# EasyEDA Pro project ProPrj_电赛版12_2025-08-14.epro, board PCB1
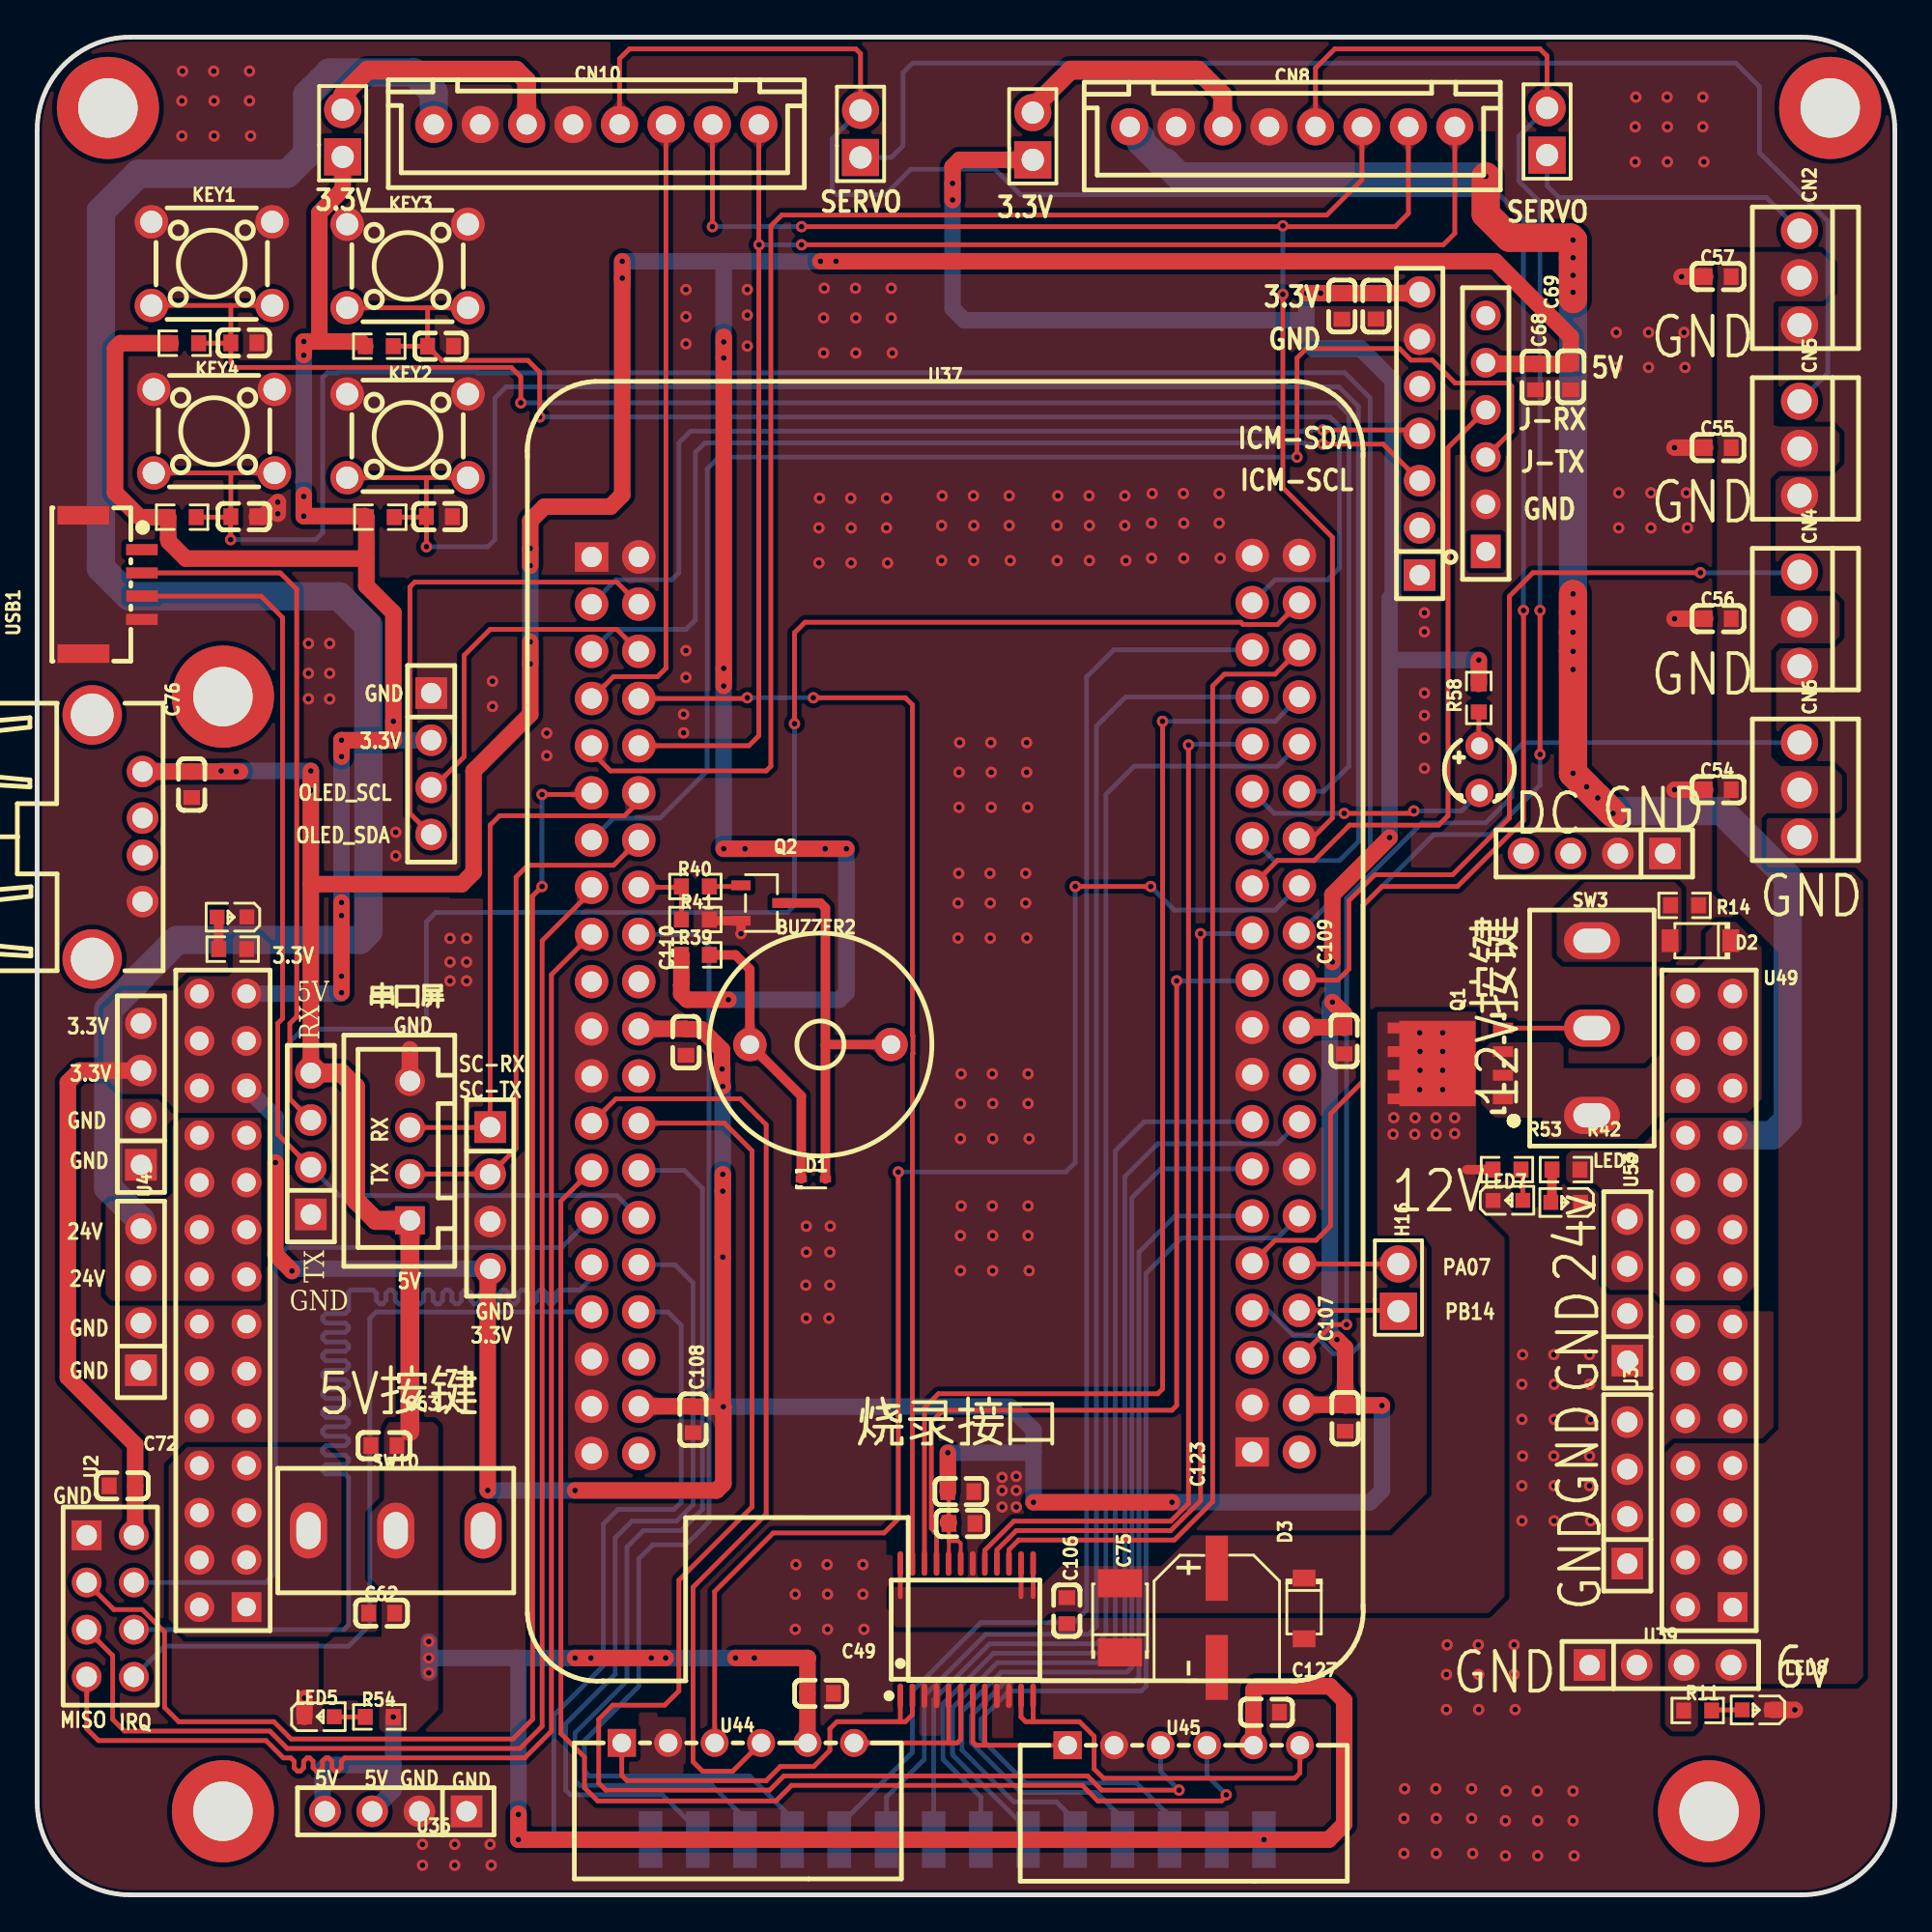
[diagram p4: board, top side]
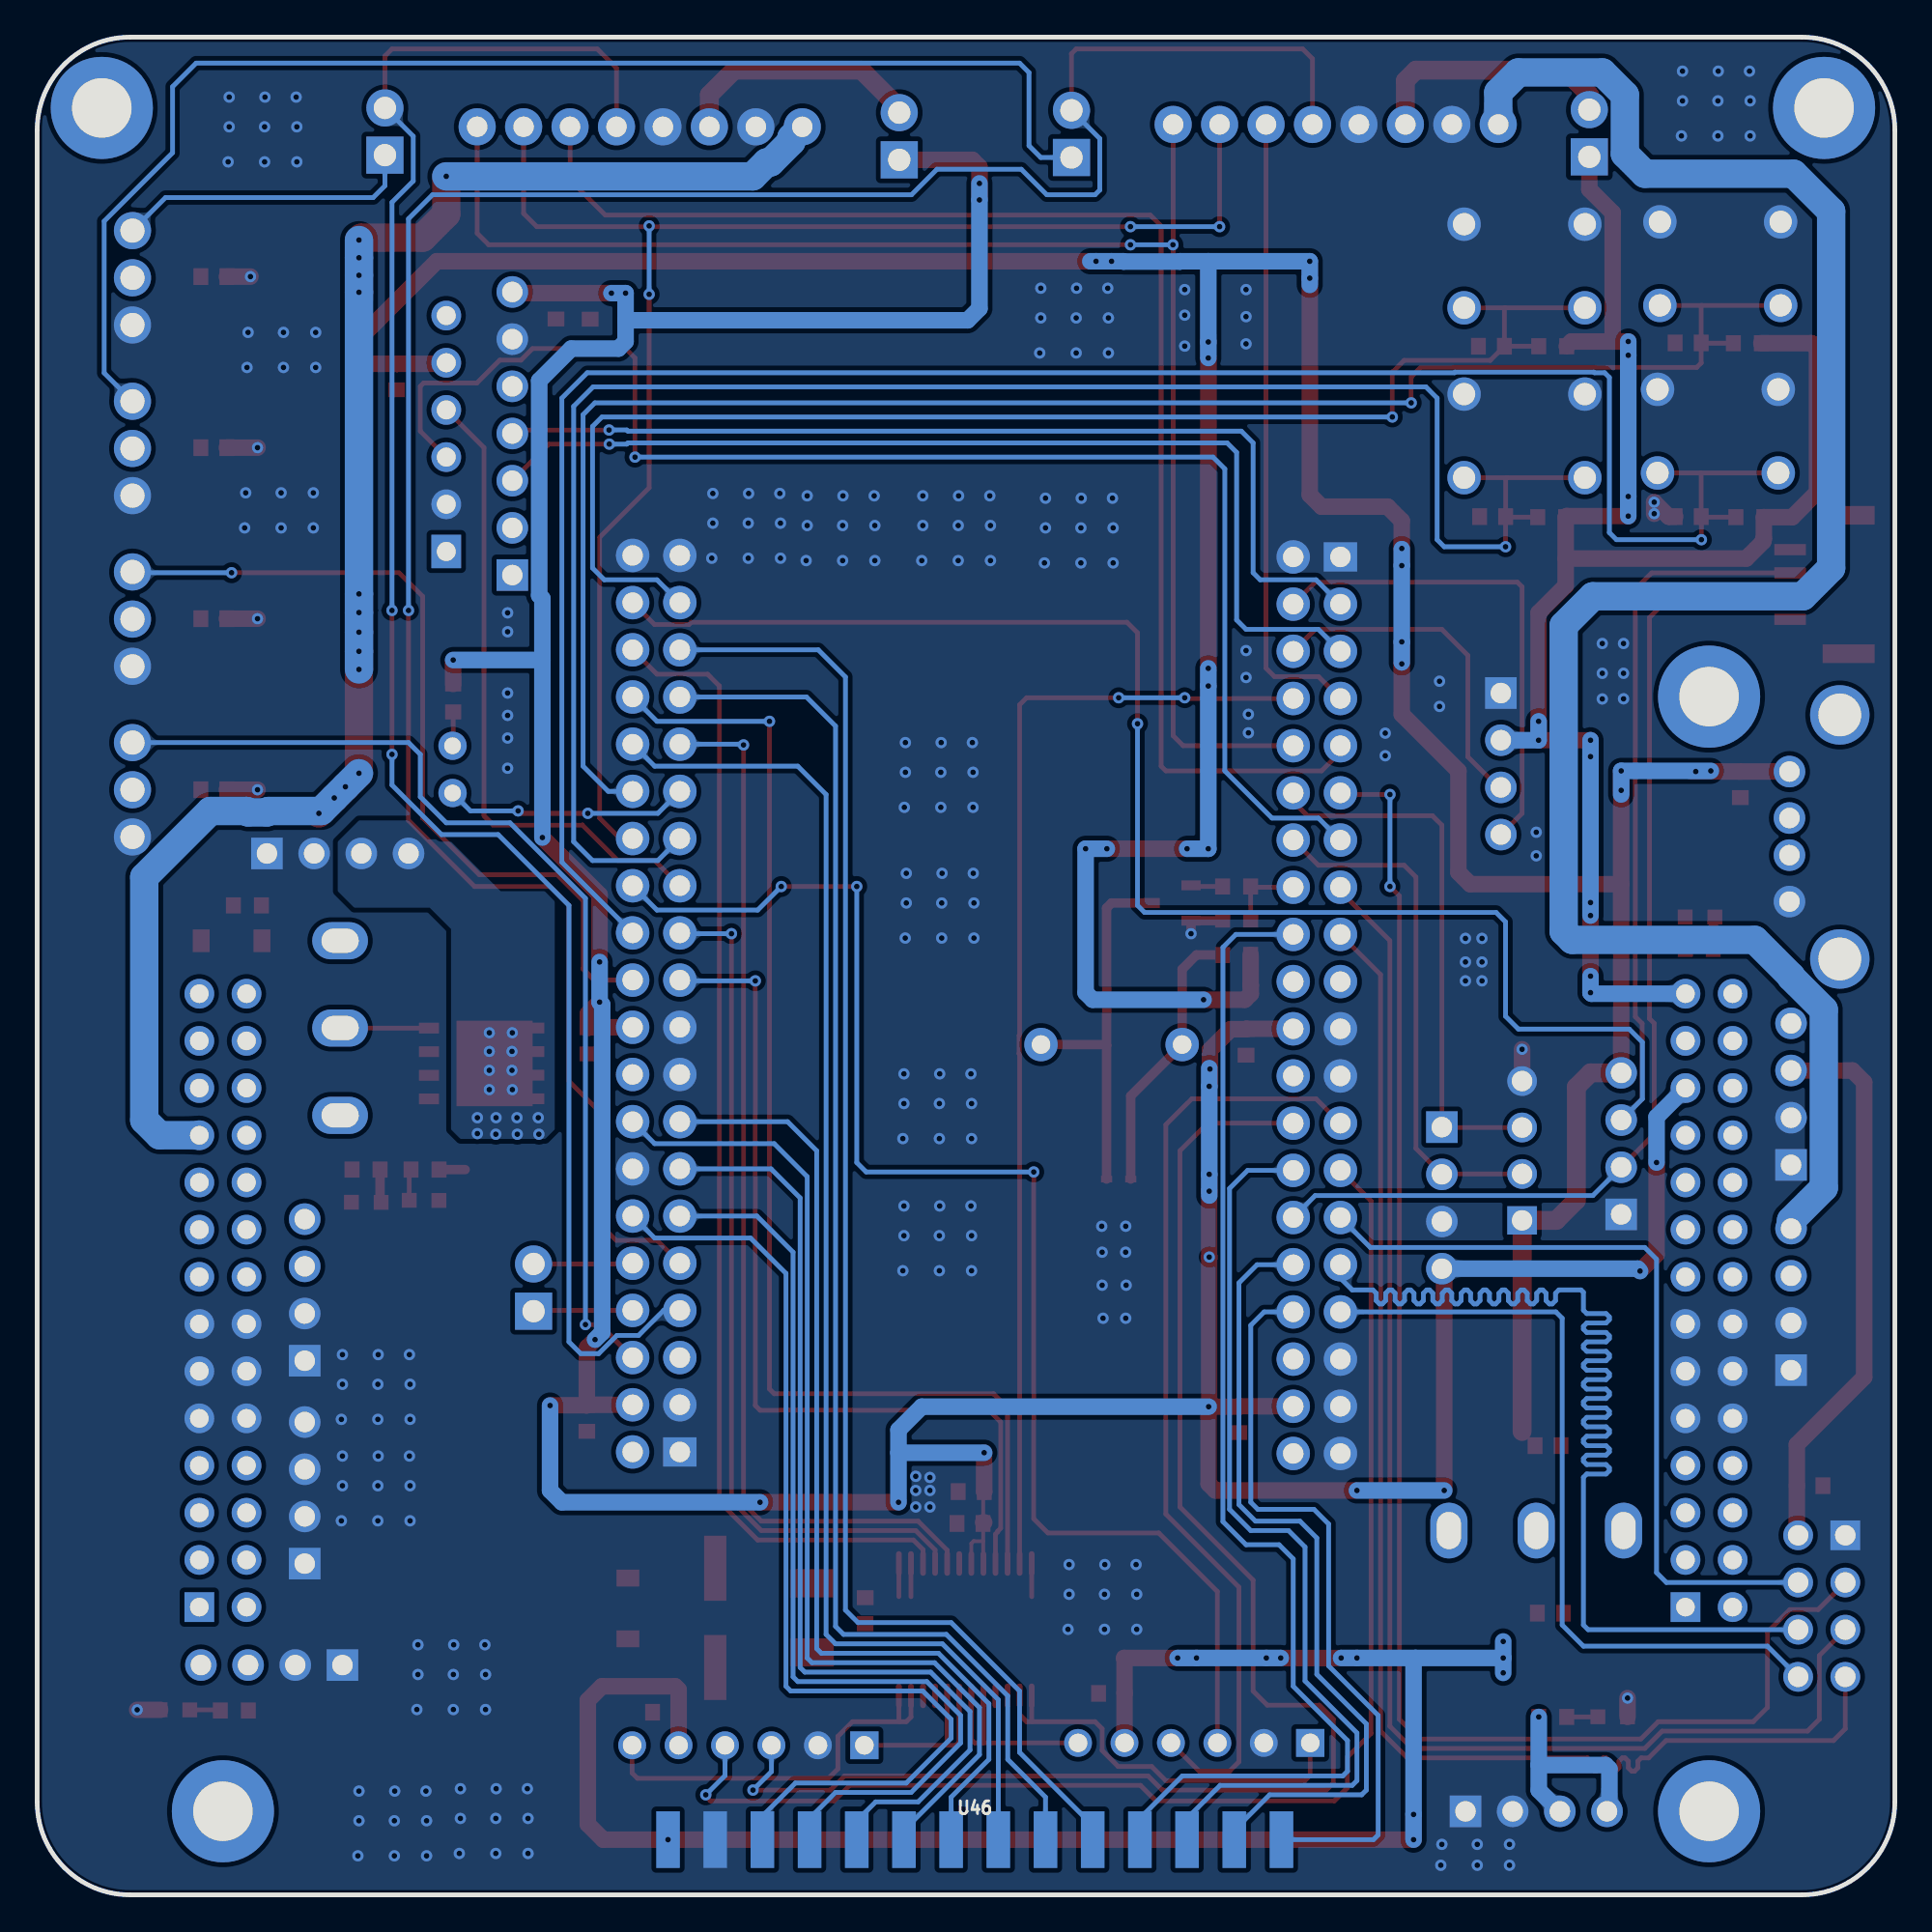
[diagram p5: board, bottom side, seen from below]

Outline 100 x 100 mm; copper layers: Top Layer, Bottom Layer. Coordinates in mm from the lower left corner of the outline.
Outline path: 0,95 0,5 arc(1.46,1.46) 5,0 95,0 arc(98.54,1.46) 100,5 100,95 arc(98.54,98.54) 95,100 5,100 arc(1.46,98.54) 0,95
Stack: Top Layer 0.035mm / Dielectric1 1.51mm FR4 er 4.5 / Bottom Layer 0.035mm

## Design rules (mm)
template: 自定义配置
spacing copperThickness1oz (default): track to track 0.102, other pairs 0.152 to 0.3
spacing copperThickness2oz: track to track 0.203, other pairs 0.152 to 0.3
track width copperThickness1oz (default): min 0.152, default 0.254, max 0.508
track width VCC: min 0.203, default 0.889, max 1.27
track width motor: min 0.762, default 1.524, max 2.54
differential pair differentialPair (default): width min 0.127, default 0.254, max 2.54; gap min 0.152, default 0.152
via viaSize (default): diameter min 0.5, default 0.61, max 10; hole min 0.3, default 0.305, max 6.299
net +5V uses VCC
net GND uses VCC
net +6V uses VCC
net 3.3V uses VCC
net +3V3_V2 uses VCC
net 24V_2 uses motor
net +3V3_V1 uses VCC
net 24V_1 uses motor
net +POW uses VCC
net 5V uses VCC
net PB2 uses netLength
net MOSI uses netLength
net MISO uses netLength
eq len grp SPI uses netLength

## Placement (name value [footprint] x y rotation side)
BUZZER2  2300Hz  [BUZ-TH_BD12.0-P7.60-D0.6-FD]  42.16 45.77 0 top
C49  100nF  [C0603]  42.16 10.85 180 top
C54  100nF  [C0603]  90.49 59.49 0 top
C55  100nF  [C0603]  90.49 77.9 0 top
C56  100nF  [C0603]  90.49 68.69 0 top
C57  100nF  [C0603]  90.49 87.11 0 top
C62  10uF  [C0603]  18.55 15.16 0 top
C63  0.1uF  [C0603]  18.67 24.18 180 top
C68  10uF  [C0603]  80.65 81.71 90 top
C69  0.1uF  [C0603]  82.55 81.71 270 top
C72  100nF  [C0603]  4.58 22.02 180 top
C73  10uF  [C0603]  72.07 85.53 90 top
C74  0.1uF  [C0603]  70.23 85.52 270 top
C75  10uF  [CASE-B_3528]  58.29 14.91 90 top
C76  100nF  [C0603]  8.32 59.77 270 top
C98  100nF  [C0603]  49.72 21.71 180 top
C99  100nF  [C0603]  49.78 19.99 180 top
C102  100nF  [C0603]  11.12 74.19 180 top
C103  100nF  [C0603]  21.65 74.19 180 top
C106  100nF  [C0603]  55.43 15.3 90 top
C107  100nF  [C0603]  70.41 25.65 270 top
C108  100nF  [C0603]  35.31 25.58 90 top
C109  100nF  [C0603]  70.35 45.97 270 top
C110  100nF  [C0603]  34.93 45.9 270 top
C123  10uF  [CAP-SMD_BD6.3-L6.6-W6.6-FD]  63.5 14.91 270 top
C125  100nF  [C0603]  11.12 83.54 180 top
C126  100nF  [C0603]  21.72 83.36 180 top
C127  100nF  [C0603]  66.17 9.83 180 top
CN2  640456-3  [CONN-TH_640456-3]  94.87 87.05 90 top
CN4  640456-3  [CONN-TH_640456-3]  94.87 68.67 90 top
CN5  640456-3  [CONN-TH_640456-3]  94.87 77.86 90 top
CN6  640456-3  [CONN-TH_640456-3]  94.87 59.49 90 top
CN7  ZX-XH2.54-4PZZ  [CONN-TH_4P-P2.50_4PIN]  20.07 40.06 90 top
CN8  ZX-XH2.54-8PZZ  [CONN-TH_8P-P2.50-XH2.54-8P]  67.56 95.17 0 top
CN10  ZX-XH2.54-8PZZ  [CONN-TH_8P-P2.50-XH2.54-8P]  30.1 95.3 0 top
D1  1N4148WT  [SOD-523_L1.2-W0.8-LS1.6-RD]  41.78 38.53 0 top
D2  BZT52C16  [SOD-123_L2.7-W1.6-LS3.7-RD]  89.53 51.36 180 top
D3  BZT52C16  [SOD-123_L2.7-W1.6-LS3.7-RD]  68.2 15.42 270 top
H1  PZ254V-11-07P  [HDR-TH_7P-P2.54-V-M]  74.42 78.66 90 top
H11  PZ254V-11-02P  [HDR-TH_2P-P2.54-V-M]  53.59 94.67 90 top
H12  2.54-1*4P母  [hdr-th_4p-p2.54-v-f]  21.21 60.88 270 top
H13  PZ254V-11-02P  [HDR-TH_2P-P2.54-V-M]  81.28 94.92 90 top
H14  PZ254V-11-02P  [HDR-TH_2P-P2.54-V-M]  16.45 94.83 90 top
H15  PZ254V-11-02P  [HDR-TH_2P-P2.54-V-M]  44.32 94.79 90 top
H16  PZ254V-11-02P  [HDR-TH_2P-P2.54-V-M]  73.28 32.69 90 top
KEY1  TS665CJ  [SW-TH_4P-L6.0-W6.0-P4.50-LS6.5]  9.4 87.81 0 top
KEY2  TS665CJ  [SW-TH_4P-L6.0-W6.0-P4.50-LS6.5]  19.94 78.54 0 top
KEY3  TS665CJ  [SW-TH_4P-L6.0-W6.0-P4.50-LS6.5]  19.94 87.68 0 top
KEY4  TS665CJ  [SW-TH_4P-L6.0-W6.0-P4.50-LS6.5]  9.53 78.79 0 top
LED4  XL-1608SURC-06  [LED0603-RD_RED]  10.49 52.64 180 top
LED5  XL-1608SURC-06  [LED0603-RD_RED]  15.19 9.58 0 top
LED7  XL-1608SURC-06  [LED0603-RD_RED]  79.17 37.38 0 top
LED8  XL-1608SURC-06  [LED0603-RD_RED]  92.58 9.96 180 top
LED9  XL-1608SURC-06  [LED0603-RD_RED]  82.28 37.28 180 top
LED11  XL-302SURD  [LED-TH_BD3.8-P2.54-RD]  77.64 60.58 90 top
NOREF  -  [Pad_e109]  96.52 96.19 0 top
NOREF#2  -  [Pad_e105]  10 64.5 0 top
NOREF#3  -  [Pad_e103]  90 4.5 0 top
NOREF#4  -  [Pad_e108]  3.81 96.19 0 top
NOREF#5  -  [Pad_e104]  10 4.5 0 top
P1  2.54-1*6P母  [hdr-th_6p-p2.54-v-f]  77.98 78.66 90 top
Q1  AON6403-VB  [PDFN-8_L4.9-W5.8-P1.27-LS6.1-BL]  76.07 44.75 90 top
Q2  S8050 J3Y  [SOT-23-3_L3.0-W1.7-P0.95-LS2.9-BR]  38.99 53.39 180 top
R11  1K  [R0603]  89.39 9.93 0 top
R14  10K  [R0603]  88.68 53.26 180 top
R39  10Ω  [R0603]  35.43 50.6 0 top
R40  4.7kΩ  [R0603]  35.43 54.28 0 top
R41  1kΩ  [R0603]  35.43 52.5 0 top
R42  8K  [R0603]  82.3 39.04 180 top
R44  10kΩ  [R0603]  18.47 74.16 0 top
R46  10kΩ  [R0603]  7.81 74.16 0 top
R53  1kΩ  [R0603]  79.12 39.04 180 top
R54  1kΩ  [R0603]  18.42 9.58 0 top
R55  1kΩ  [R0603]  10.53 50.91 0 top
R58  1kΩ  [R0603]  77.61 64.43 90 top
R59  10kΩ  [R0603]  7.94 83.53 0 top
R60  10kΩ  [R0603]  18.42 83.36 0 top
SW3  SS-12D10L5  [SW-TH_SS-12D10L5]  83.69 46.66 270 top
SW10  SS-12D10L5  [SW-TH_SS-12D10L5]  19.3 19.61 0 top
U2  2.54-2*4  [HDR-TH_8P-P2.54-V-F-R2-C4-S2.54]  3.94 15.54 270 top
U35  PM254-1-04-Z-8.5  [hdr-th_4p-p2.54-v-f]  14.73 40.44 90 top
U36  PM254-1-04-Z-8.5  [hdr-th_4p-p2.54-v-f]  19.3 4.5 180 top
U37  LCKFB-TMX-MSPM0G3507  [COMM-TH_LCKFB-TMX-MSPM0G3507]  48.9 47.93 0 top
U38  PM254-1-04-Z-8.5  [hdr-th_4p-p2.54-v-f]  85.6 21.64 90 top
U39  PM254-1-04-Z-8.5  [hdr-th_4p-p2.54-v-f]  87.38 12.37 0 top
U40  TB6612FNG,C,8,EL  [SSOP-24_L8.3-W5.6-P0.65-LS7.6-BL]  50.04 14.28 0 top
U41  PM254-1-04-Z-8.5  [hdr-th_4p-p2.54-v-f]  5.59 32.06 90 top
U44  ZX-XH2.54-6PWZ  [CONN-TH_6P-P2.50_ZX-XH2.54-6PWZ]  37.72 8.18 0 top
U45  ZX-XH2.54-6PWZ  [CONN-TH_6P-P2.50_ZX-XH2.54-6PWZ]  61.72 8.05 0 top
U46  PM254-1-14-Z-8.5  [HDR-TH_14P-P2.54-V-F-1]  49.53 2.97 180 bottom
U48  WAFER-GH1.25-4PWB  [CONN-SMD_4P-P1.25_XUNPU_WAFER-GH1.25-4PWB]  4.06 70.54 270 top
U49  HC-PM254-8.5H-2x14PZ  [HDR-TH_28P-P2.54-V-F-R2-C14-S2.54]  90 32 90 top
U50  HC-PM254-8.5H-2x14PZ  [HDR-TH_28P-P2.54-V-F-R2-C14-S2.54]  10 32 90 top
U51  PM254-1-04-Z-8.5  [hdr-th_4p-p2.54-v-f]  5.59 43.1 90 top
U52  PM254-1-04-Z-8.5  [hdr-th_4p-p2.54-v-f]  83.82 56.06 180 top
U53  PM254-1-04-Z-8.5  [hdr-th_4p-p2.54-v-f]  85.6 32.56 90 top
U54  PM254-1-04-Z-8.5  [hdr-th_4p-p2.54-v-f]  24.38 37.52 270 top
USB1  AF 90° WJDG  [USB-A-TH_AF-WJDG]  4.32 56.95 270 top

## Footprints (pads in the part's own frame, mm; a bottom-side part is the same pattern mirrored in y, then rotated)
BUZ-TH_BD12.0-P7.60-D0.6-FD
  round 1.8 hole 1: 1(-3.8,0) 2(3.8,0)
C0603
  rect 0.8x0.9 smd: 1(-0.7,0) 2(0.7,0)
CAP-SMD_BD6.3-L6.6-W6.6-FD
  rect 3.5x1.2 smd: 1(-2.67,0) 2(2.67,0)
CASE-B_3528
  rect 1.506x2.376 smd: 1(-1.861,0) 2(1.861,0)
COMM-TH_LCKFB-TMX-MSPM0G3507
  rect 1.8x1.575 hole 1.1: 1(-19.05,24.09) 41(16.51,-24.09)
  round 1.8 hole 1.1: 2(-16.51,24.09) 3(-19.05,21.549) 4(-16.51,21.549) 5(-19.05,19.009) 6(-16.51,19.009) 7(-19.05,16.47) 8(-16.51,16.47) 9(-19.05,13.93) 10(-16.51,13.93) 11(-19.05,11.389) 12(-16.51,11.389) 13(-19.05,8.85) 14(-16.51,8.85) 15(-19.05,6.309) 16(-16.51,6.309) 17(-19.05,3.769) 18(-16.51,3.769) 19(-19.05,1.23) 20(-16.51,1.23) 21(-19.05,-1.31) 22(-16.51,-1.31) 23(-19.05,-3.85) 24(-16.51,-3.85) 25(-19.05,-6.391) 26(-16.51,-6.391) 27(-19.05,-8.931) 28(-16.51,-8.931) 29(-19.05,-11.47) 30(-16.51,-11.47) 31(-19.05,-14.011) 32(-16.51,-14.011) 33(-19.05,-16.55) 34(-16.51,-16.55) 35(-19.05,-19.09) 36(-16.51,-19.09) 37(-19.05,-21.631) 38(-16.51,-21.631) 39(-19.05,-24.171) 40(-16.51,-24.171) 42(19.05,-24.09) 43(16.51,-21.549) 44(19.05,-21.549) 45(16.51,-19.009) 46(19.05,-19.009) 47(16.51,-16.47) 48(19.05,-16.47) 49(16.51,-13.93) 50(19.05,-13.93) 51(16.51,-11.389) 52(19.05,-11.389) 53(16.51,-8.85) 54(19.05,-8.85) 55(16.51,-6.309) 56(19.05,-6.309) 57(16.51,-3.769) 58(19.05,-3.769) 59(16.51,-1.23) 60(19.05,-1.23) 61(16.51,1.31) 62(19.05,1.31) 63(16.51,3.85) 64(19.05,3.85) 65(16.51,6.391) 66(19.05,6.391) 67(16.51,8.931) 68(19.05,8.931) 69(16.51,11.47) 70(19.05,11.47) 71(16.51,14.011) 72(19.05,14.011) 73(16.51,16.55) 74(19.05,16.55) 75(16.51,19.09) 76(19.05,19.09) 77(16.51,21.631) 78(19.05,21.631) 79(16.51,24.171) 80(19.05,24.171)
CONN-SMD_4P-P1.25_XUNPU_WAFER-GH1.25-4PWB
  rect 0.6x1.7 smd: 1(-1.875,1.575) 2(-0.625,1.575) 3(0.625,1.575) 4(1.875,1.575)
  rect 1x2.8 smd: 5(3.725,-1.575) 6(-3.725,-1.575)
CONN-TH_4P-P2.50_4PIN
  rect 1.524x1.6 hole 1.1: 1(-3.75,0)
  round 1.6 hole 1.1: 2(-1.25,0) 3(1.25,0) 4(3.75,0)
CONN-TH_6P-P2.50_ZX-XH2.54-6PWZ
  rect 1.524x1.5 hole 1: 1(-6.25,0)
  round 1.5 hole 1: 2(-3.75,0) 3(-1.25,0) 4(1.25,0) 5(3.75,0) 6(6.25,0)
CONN-TH_8P-P2.50-XH2.54-8P
  round 2 hole 1.1: 1(8.75,0) 2(6.25,0) 3(3.75,0) 4(1.25,0) 5(-1.25,0) 6(-3.75,0) 7(-6.25,0) 8(-8.75,0)
CONN-TH_640456-3
  round 2 hole 1.3: 1(-2.54,0) 2(0,0) 3(2.54,0)
HDR-TH_2P-P2.54-V-M
  rect 2x2 hole 1.2: 1(-1.27,0)
  round 2 hole 1.2: 2(1.27,0)
hdr-th_4p-p2.54-v-f
  rect 1.7x1.7 hole 1.1: 1(-3.81,0)
  round 1.7 hole 1.1: 2(-1.27,0) 3(1.27,0) 4(3.81,0)
hdr-th_6p-p2.54-v-f
  rect 1.8x1.6 hole 1.02: 1(-6.35,0)
  round 1.6 hole 1.02: 2(-3.81,0) 3(-1.27,0) 4(1.27,0) 5(3.81,0) 6(6.35,0)
HDR-TH_7P-P2.54-V-M
  rect 1.7x1.7 hole 1.1: 1(-7.62,0)
  round 1.7 hole 1.1: 2(-5.08,0) 3(-2.54,0) 4(0,0) 5(2.54,0) 6(5.08,0) 7(7.62,0)
HDR-TH_8P-P2.54-V-F-R2-C4-S2.54
  rect 1.6x1.6 hole 1.1: 1(-3.81,-1.27)
  round 1.6 hole 1.1: 2(-3.81,1.27) 3(-1.27,-1.27) 4(-1.27,1.27) 5(1.27,-1.27) 6(1.27,1.27) 7(3.81,-1.27) 8(3.81,1.27)
HDR-TH_14P-P2.54-V-F-1
  rect 1.27x3.048 smd: 1(-16.51,0) 2(-13.97,0) 3(-11.43,0) 4(-8.89,0) 5(-6.35,0) 6(-3.81,0) 7(-1.27,0) 8(1.27,0) 9(3.81,0) 10(6.35,0) 11(8.89,0) 12(11.43,0) 13(13.97,0) 14(16.51,0)
HDR-TH_28P-P2.54-V-F-R2-C14-S2.54
  rect 1.6x1.6 hole 1: 1(-16.51,-1.27)
  round 1.6 hole 1: 2(-16.51,1.27) 3(-13.97,-1.27) 4(-13.97,1.27) 5(-11.43,-1.27) 6(-11.43,1.27) 7(-8.89,-1.27) 8(-8.89,1.27) 9(-6.35,-1.27) 10(-6.35,1.27) 11(-3.81,-1.27) 12(-3.81,1.27) 13(-1.27,-1.27) 14(-1.27,1.27) 15(1.27,-1.27) 16(1.27,1.27) 17(3.81,-1.27) 18(3.81,1.27) 19(6.35,-1.27) 20(6.35,1.27) 21(8.89,-1.27) 22(8.89,1.27) 23(11.43,-1.27) 24(11.43,1.27) 25(13.97,-1.27) 26(13.97,1.27) 27(16.51,-1.27) 28(16.51,1.27)
LED0603-RD_RED
  rect 0.8x0.8 smd: 1(-0.799,-0.004) 2(0.799,0.004)
LED-TH_BD3.8-P2.54-RD
  round 1.524 hole 0.9: 1(-1.27,0) 2(1.27,0)
Pad_e103
  round 5.5 hole 3.2: 101(0,0)
Pad_e104
  round 5.5 hole 3.2: 101(0,0)
Pad_e105
  round 5.5 hole 3.2: 101(0,0)
Pad_e108
  round 5.5 hole 3.2: 101(0,0)
Pad_e109
  round 5.5 hole 3.2: 101(0,0)
PDFN-8_L4.9-W5.8-P1.27-LS6.1-BL
  rect 0.58x1.079 smd: 1(-1.907,-2.834) 2(-0.637,-2.834) 3(0.632,-2.834) 4(1.903,-2.834)
  rect 0.58x1.08 smd: 5(1.907,2.834) 6(0.637,2.834) 7(-0.632,2.834) 8(-1.903,2.834)
  rect 4.6x4.1 smd: 9(-0.003,0.695)
R0603
  rect 0.806x0.864 smd: 1(-0.753,0) 2(0.753,0)
SOD-123_L2.7-W1.6-LS3.7-RD
  rect 0.91x1.22 smd: 1(-1.635,0) 2(1.635,0)
SOD-523_L1.2-W0.8-LS1.6-RD
  rect 0.6x0.36 smd: 1(-0.65,0) 2(0.65,0)
SOT-23-3_L3.0-W1.7-P0.95-LS2.9-BR
  rect 1.038x0.532 smd: 1(1.101,-0.95) 2(1.101,0.95) 3(-1.101,0)
SSOP-24_L8.3-W5.6-P0.65-LS7.6-BL
  oval 0.308x1.324 smd: 1(-3.575,-3.562) 2(-2.925,-3.562) 3(-2.275,-3.562) 4(-1.625,-3.562) 5(-0.975,-3.562) 6(-0.325,-3.562) 7(0.325,-3.562) 8(0.975,-3.562) 9(1.625,-3.562) 10(2.275,-3.562) 11(2.925,-3.562) 12(3.575,-3.562) 13(3.575,3.562) 14(2.925,3.562) 15(2.275,3.562) 16(1.625,3.562) 17(0.975,3.562) 18(0.325,3.562) 19(-0.325,3.562) 20(-0.975,3.562) 21(-1.625,3.562) 22(-2.275,3.562) 23(-2.925,3.562) 24(-3.575,3.562)
SW-TH_4P-L6.0-W6.0-P4.50-LS6.5
  round 1.8 hole 1.2: 1(-3.25,2.25) 2(3.25,2.25) 3(-3.25,-2.25) 4(3.25,-2.25)
SW-TH_SS-12D10L5
  oval 2x3 hole 1.3x2: 1(-4.7,0) 2(0,0) 3(4.7,0)
USB-A-TH_AF-WJDG
  round 1.7 hole 1.1: 1(-3.521,1.355) 2(-1.018,1.355) 3(0.981,1.355) 4(3.48,1.355)
  round 3.2 hole 2.3: 5(-6.57,-1.355) 5(6.57,-1.355)

## Nets
As in the schematic, except:
GND: C49.1 C54.1 C55.1 C56.1 C57.1 C62.1 C63.2 C68.1 C69.2 C72.2 C73.1 C74.2 C75.1 C76.2 C98.1 C99.1 C102.1 C103.1 C106.1 C107.2 C108.1 C109.2 C110.2 C123.2 C125.1 C126.1 C127.1 CN2.1 CN4.1 CN5.1 CN6.1 CN7.4 CN8.5 CN8.7 CN10.5 CN10.7 D3.2 H1.6 H12.1 KEY1.1 KEY1.2 KEY2.1 KEY2.2 KEY3.1 KEY3.2 KEY4.1 KEY4.2 LED4.1 LED5.1 LED7.1 LED8.1 LED9.1 P1.2 Q2.2 R14.1 R41.2 U2.1 U35.1 U36.1 U36.2 U37.1 U37.2 U37.21 U37.23 U37.35 U37.37 U37.39 U37.41 U37.43 U37.54 U37.57 U37.59 U37.79 U37.80 U38.1 U38.2 U38.3 U38.4 U39.1 U39.2 U40.3 U40.4 U40.9 U40.10 U40.18 U41.1 U41.2 U44.2 U45.2 U46.2 U48.4 U48.5 U48.6 U49.9 U49.10 U49.11 U49.12 U49.13 U49.14 U50.9 U50.10 U50.11 U50.12 U50.13 U50.14 U51.1 U51.2 U52.1 U52.2 U53.1 U53.2 U54.3 USB1.4
KEY1: C125.2 KEY1.3 KEY1.4 R59.2 U37.70
KEY2: C103.2 KEY2.3 KEY2.4 R44.2 U37.67
KEY3: C126.2 KEY3.3 KEY3.4 R60.2 U37.77
KEY4: C102.2 KEY4.3 KEY4.4 R46.2 U37.64
MOTOR_ENCODE1A: U37.66 U44.3
MOTOR_ENCODE1B: U37.25 U44.4
MOTOR_ENCODE2A: U37.26 U45.3
MOTOR_ENCODE2B: U37.27 U45.4
MOTORA1: U40.1 U40.2 U44.1
MOTORA2: U40.5 U40.6 U44.6
MOTORB1: U40.11 U40.12 U45.6
MOTORB2: U40.7 U40.8 U45.1

Pads without a net: H1 1 2 5; NOREF 101; NOREF#2 101; NOREF#3 101; NOREF#4 101; NOREF#5 101; P1 1 6; SW10 3; U37 19 20 24 36 40 42 45 58; U48 1; USB1 2 3 5

## Via types
v1: diameter 0.61, hole 0.305, Top Layer to Bottom Layer, 362 vias

## Routing (per net, layer and track width the routed paths; a pad name or vN(x,y) marks a point on that pad's centre or on a via; arc(x,y) is an arc through that point)
3.3V: length 382.3
  Top Layer w0.203: 49.06,17.84 49.08,17.85 49.08,19.04 ; C98.2 49.08,21.65 49.08,19.04 ; 49.71,17.84 49.71,18.92 49.59,19.04 49.08,19.04
  Top Layer w0.889: H1.7 74.36,86.22 C74.1 v1(69.09,86.22) v1(68.33,86.22) ; R58.2 v1(77.61,66.47) ; v1(28.96,21.77) 36.58,21.77 36.94,22.13 v1(36.94,26.28) ; v1(36.94,26.28) C108.2 35.28,26.3 32.38,26.3 ; v1(36.94,26.28) 36.91,26.31 v1(36.91,34.33) v1(36.91,37.88) v1(36.91,38.79) ; U54.4 24.26,33.58 v1(24.26,21.77) ; C107.1 70.38,26.38 67.94,26.38 ; C107.1 72.38,26.35 v1(72.39,26.34) ; C107.1 70.41,29.45 v1(69.97,29.89) ; v1(13.72,33.58) 12.83,34.47 v1(12.83,39.42) ; 15.19,83.62 v1(14.35,83.62) 14.35,82.89 ; 15.19,83.62 15.19,83.69 15.19,83.7 15.19,90.55 16.45,91.81 H14.1 ; 15.19,83.62 17.41,83.62 R60.1 ; 17.72,71.93 17.72,70.47 19.18,69.01 v1(19.18,63.17) v1(19.18,62.15) v1(16.38,62.15) v1(16.38,61.27) ; 17.72,71.93 R44.1 17.66,74.22 v1(14.35,74.22) 14.35,75.36 ; 17.72,71.93 8,71.93 7.09,72.85 7.09,72.96 7.05,72.99 R46.1 5.52,74.16 4.19,75.49 4.19,83.24 4.48,83.53 R59.1 ; U51.3 2.29,44.37 1.65,43.74 1.65,27.86 5.28,24.24 C72.1 5.28,19.42 U2.2 ; v1(36.91,43.52) 36.87,43.56 v1(36.87,44.45) 36.87,45.48 35.75,46.6 C110.1 34.9,46.62 32.38,46.62 ; 49.02,20.05 49.08,20.05 ; C98.2 49.02,21.71 v1(49.02,23.8) ; v1(72.8,56.92) 69.72,53.83 v1(69.72,50.22) ; H11.1 49.66,93.4 49.28,93.02 v1(49.28,92.13) v1(49.28,91.24) ; v1(16.38,48.56) v1(16.38,49.45) v1(16.38,52.71) v1(16.38,53.42) ; v1(69.72,48.06) 70.35,47.43 C109.1 70.33,46.7 67.94,46.7 ; v1(53.63,21.13) v1(61.09,21.13)
  Bottom Layer w0.889: U54.4 13.84,33.71 v1(13.72,33.58) ; U50.27 16.33,48.51 v1(16.38,48.56) v1(16.38,49.45) ; v1(72.39,26.34) 72.39,21.77 71.75,21.13 v1(61.09,21.13) ; v1(69.97,29.89) 69.58,30.27 69.58,47.92 v1(69.72,48.06) v1(69.72,50.22) ; v1(49.28,92.13) v1(49.28,91.24) 49.28,85.39 49.91,84.76 68.33,84.76 ; 68.33,84.76 68.33,83.62 68.71,83.24 71.25,83.24 72.97,81.51 72.97,69.95 72.8,69.77 72.8,66.43 ; 68.33,84.76 v1(68.33,86.22) v1(69.09,86.22) ; 53.63,23.8 v1(49.02,23.8) ; 53.63,23.8 53.63,25.03 52.38,26.28 v1(36.94,26.28) ; 53.63,23.8 v1(53.63,21.13) ; 36.91,37.64 v1(36.91,38.79) v1(36.91,43.52) 36.91,44.5 ; v1(16.38,52.71) v1(16.38,53.42) v1(16.38,61.27) v1(16.38,62.15) ; v1(12.83,39.42) 12.83,41.87 U50.23 ; v1(72.8,56.92) 72.8,66.43 ; 72.8,66.43 72.84,66.47 v1(77.61,66.47) ; v1(14.35,74.22) v1(14.35,75.27) v1(14.35,82.87) v1(14.35,83.62) ; H12.2 v1(19.18,62.15) v1(19.18,63.17) ; v1(28.96,21.77) v1(24.26,21.77)
24V_1: length 104.7
  Bottom Layer w1.524: CN10.8 21.35,97.02 20.27,98.1 15.74,98.1 14.53,96.89 14.53,93.72 13.46,92.65 5.45,92.65 3.43,90.63 3.43,71.42 4.95,69.9 16.26,69.9 17.83,68.33 17.83,51.87 17.37,51.41 7.54,51.41 5.59,49.45 5.59,49.41 3.82,47.64 3.82,38.06 5.59,36.3 5.59,35.86
24V_2: length 97
  Top Layer w1.524: v1(84.84,58.22) v1(84.01,59.05) v1(83.41,59.65) v1(82.68,60.38) v1(82.68,65.96) v1(82.68,66.94) v1(82.68,67.97) v1(82.68,69.03) v1(82.68,70.03) ; v1(77.98,92.51) 77.98,90.48 79.25,89.2 82.55,89.2 v1(82.68,89.08) v1(82.68,88.12) v1(82.68,87.18) v1(82.68,86.27) 82.68,85.9
  Bottom Layer w1.524: v1(82.68,60.38) v1(83.41,59.65) v1(84.01,59.05) 84.71,58.34 87.56,58.34 87.63,58.27 88.64,58.27 88.72,58.34 90.68,58.34 94.23,54.79 94.23,41.71 93.42,40.89 U49.21 ; v1(77.98,92.51) 61.48,92.51 60.73,93.26 60.52,93.26 59.4,94.38 59.4,94.59 CN8.8 ; v1(82.68,89.08) v1(82.68,88.12) v1(82.68,87.18) v1(82.68,86.27) v1(82.68,70.03) v1(82.68,69.03) v1(82.68,67.97) v1(82.68,66.94) v1(82.68,65.96)
+3V3_V1: length 13.8
  Top Layer w1.016: CN10.6 26.35,97.65 25.78,98.22 17.78,98.22 16.45,96.89 H14.2
+3V3_V2: length 13.6
  Top Layer w1.016: H11.2 53.59,96.19 55.63,98.22 62.48,98.22 63.81,96.89 CN8.6
+5V: length 335.4
  Top Layer w0.889: USB1.1 C76.1 10.92,60.47 ; P1.5 78.04,82.41 C68.2 C69.1 82.55,83.87 78.49,87.94 v1(43,87.94) v1(42.16,87.94) ; 25.91,4.37 v1(25.91,2.97) v1(66.04,2.97) 69.53,2.97 70.36,3.8 70.36,10.47 69.6,11.23 65.66,11.23 65.47,11.04 C127.2 65.47,8.05 U45.5 ; v1(36.96,56.31) v1(38.1,56.31) v1(42.42,56.31) v1(43.56,56.31) ; v1(31.5,87.94) v1(31.5,87.03) 31.5,75.36 30.86,74.73 27.31,74.73 26.54,73.97 v1(26.54,72.48) v1(26.54,71.55) ; U35.4 14.73,54.41 ; 14.73,54.41 22.86,54.41 23.5,55.04 23.5,60.5 26.54,63.55 v1(26.54,66.26) v1(26.54,67.45) ; 14.73,54.41 v1(14.73,59.46) v1(14.73,60.5) ; R39.1 34.68,48.95 34.67,48.95 34.67,48.5 34.99,48.18 v1(37.21,48.18) ; U44.5 41.46,8.18 C49.2 41.46,12.73 41.49,12.75 v1(38.61,12.75) v1(37.59,12.75) ; v1(28.96,12.75) v1(29.81,12.75) v1(33.06,12.75) v1(33.83,12.75) ; v1(36.96,65.08) v1(36.96,66.02) v1(36.96,82.73) 36.96,83.87
  Top Layer w1.016: U35.4 16.38,44.25 17.14,43.48 17.14,37.39 18.23,36.31 CN7.1 20.07,24.94
  Bottom Layer w0.889: v1(37.21,48.18) 43.18,48.18 43.56,48.56 v1(43.56,56.31) 42.42,56.31 ; 25.8,12.75 25.91,12.65 v1(25.91,4.33) v1(25.91,2.97) ; 25.8,12.75 v1(28.96,12.75) v1(29.81,12.75) ; 25.8,12.75 v1(21.08,12.75) ; 14.73,59.23 v1(14.73,60.5) v1(9.91,60.5) ; 19.17,6.99 15.57,6.99 15.37,6.78 15.37,4.62 U36.4 ; 19.17,6.99 v1(19.17,9.58) ; 19.17,6.99 19.17,5.63 U36.3 ; v1(21.08,13.64) v1(21.08,12.75) ; v1(21.08,12.75) v1(21.08,11.95) ; v1(36.96,66.02) v1(36.96,65.08) v1(36.96,56.31) v1(38.1,56.31) ; v1(38.61,12.75) v1(37.59,12.75) v1(33.83,12.75) v1(33.06,12.75) ; 26.54,72.44 v1(26.54,71.55) v1(26.54,67.45) 26.54,66.34 ; 31.5,86.67 v1(31.5,87.03) v1(31.5,87.94) 36.96,87.94 ; 43.31,87.94 v1(43,87.94) v1(42.16,87.94) 41.53,87.94 41.52,87.92 38.49,87.92 38.48,87.94 36.96,87.94 ; 36.96,87.94 v1(36.96,83.59) v1(36.96,82.73)
  vias: v1(10.72,60.47)
GND: length 14.7
  Top Layer w0.508: v1(37.89,51.74) Q2.2 36.25,52.44 R41.2
  Top Layer w0.889: C56.1 v1(88.14,68.69) ; C54.1 v1(88.14,59.49) ; 14.39,9.58 v1(14.39,10.59) ; CN7.4 v1(20.07,45.52) ; v1(12.95,74.35) v1(12.95,74.97) 12.18,74.19 C102.1 ; LED8.1 v1(94.62,9.96) ; C57.1 v1(88.52,87.11) ; C55.1 v1(88.14,77.9)
  vias: v1(7.83,98.17) v1(7.79,96.57) v1(7.79,94.68) v1(9.51,98.17) v1(9.53,96.57) v1(9.53,94.68) v1(11.43,98.17) v1(11.43,96.57) v1(11.49,94.68) v1(14.61,67.36) v1(14.61,65.76) v1(14.61,64.38) v1(15.75,67.36) v1(15.75,65.76) v1(15.75,64.38) v1(19.3,57.2) v1(19.3,55.93) v1(20.74,2.72) v1(20.74,1.59) v1(22.22,51.49) v1(22.22,50.22) v1(22.22,49.2) v1(22.48,2.72) v1(22.48,1.59) v1(23.11,51.49) v1(23.11,50.22) v1(23.11,49.2) v1(24.39,2.72) v1(24.44,1.59) v1(24.51,65.33) v1(24.51,63.97) v1(27.43,62.53) v1(27.43,61.32) v1(34.8,63.55) v1(34.8,62.55) v1(34.93,86.41) v1(34.93,84.95) v1(34.93,83.49) v1(34.93,66.98) v1(34.93,65.53) v1(38.23,86.41) v1(38.23,85.03) v1(38.23,83.37) v1(40.85,17.78) v1(40.81,16.18) v1(40.81,14.29) v1(41.4,35.99) v1(41.41,34.59) v1(41.38,32.82) v1(41.4,31.04) v1(42.12,75.18) v1(42.08,73.58) v1(42.08,71.7) v1(42.33,84.89) v1(42.33,83) v1(42.37,86.49) v1(42.53,17.78) v1(42.54,16.18) v1(42.54,14.29) v1(42.62,31.04) v1(42.69,35.99) v1(42.67,34.59) v1(42.67,32.82) v1(43.8,75.18) v1(43.81,73.58) v1(43.81,71.7) v1(44.05,86.49) v1(44.07,84.89) v1(44.07,83) v1(44.45,17.78) v1(44.45,16.18) v1(44.51,14.29) v1(45.72,75.18) v1(45.72,73.58) v1(45.78,71.7) v1(45.97,86.49) v1(45.97,84.89) v1(46.03,83) v1(48.72,75.31) v1(48.68,73.71) v1(48.68,71.82) v1(49.62,60.43) v1(49.62,58.54) v1(49.61,54.99) v1(49.57,53.39) v1(49.57,51.5) v1(49.66,62.03) v1(49.74,44.19) v1(49.7,42.6) v1(49.7,40.71) v1(49.74,37.08) v1(49.7,35.48) v1(49.7,33.6) v1(50.4,75.31) v1(50.42,73.71) v1(50.42,71.82) v1(51.34,62.03) v1(51.29,54.99) v1(51.31,53.39) v1(51.31,51.5) v1(51.36,60.43) v1(51.36,58.54) v1(51.42,44.19) v1(51.44,42.6) v1(51.44,40.71) v1(51.42,37.08) v1(51.44,35.48) v1(51.44,33.6) v1(51.94,22.47) v1(51.94,21.77) v1(51.94,20.88) v1(52.32,75.31) v1(52.32,73.71) v1(52.38,71.82) v1(52.71,22.53) v1(52.71,21.77) v1(52.71,20.88) v1(53.21,54.99) v1(53.21,53.39) v1(53.26,62.03) v1(53.26,60.43) v1(53.32,58.54) v1(53.27,51.5) v1(53.34,44.19) v1(53.34,42.6) v1(53.34,37.08) v1(53.34,35.48) v1(53.4,40.71) v1(53.4,33.6) v1(54.94,75.31) v1(54.91,73.71) v1(54.91,71.82) v1(56.62,75.31) v1(56.64,73.71) v1(56.64,71.82) v1(58.55,75.31) v1(58.55,73.71) v1(58.61,71.82) v1(60.02,75.44) v1(59.99,73.84) v1(59.99,71.95) v1(61.7,75.44) v1(61.72,73.84) v1(61.72,71.95) v1(63.63,75.44) v1(63.63,73.84) v1(63.69,71.95) v1(73.61,5.71) v1(73.58,4.12) v1(73.58,2.23) v1(74.68,69.01) v1(74.68,67.99) v1(74.68,64.69) v1(74.68,63.49) v1(74.68,62.27) v1(74.68,60.65) v1(75.29,5.71) v1(75.31,4.12) v1(75.31,2.23) v1(75.9,13.46) v1(75.86,11.86) v1(75.86,9.97) v1(77.22,5.71) v1(77.22,4.12) v1(77.27,2.23) v1(77.58,13.46) v1(77.6,11.86) v1(77.6,9.97) v1(79.04,3.99) v1(79.04,2.1) v1(79.07,5.59) v1(79.5,13.46) v1(79.5,11.86) v1(79.56,9.97) v1(79.93,27.48) v1(79.93,25.6) v1(79.93,22.02) v1(79.93,20.13) v1(79.96,29.08) v1(79.96,23.62) v1(80.75,5.59) v1(80.77,3.99) v1(80.77,2.1) v1(81.64,29.08) v1(81.64,23.62) v1(81.66,27.48) v1(81.66,25.6) v1(81.66,22.02) v1(81.66,20.13) v1(82.68,5.59) v1(82.68,3.99) v1(82.74,2.1) v1(83.57,29.08) v1(83.57,27.48) v1(83.62,25.6) v1(83.57,23.62) v1(83.57,22.02) v1(83.62,20.13) v1(85.01,84.11) v1(85.01,82.22) v1(85.13,75.47) v1(85.13,73.58) v1(86.02,95.17) v1(86.02,93.29) v1(86.06,96.77) v1(86.74,84.11) v1(86.74,82.22) v1(86.87,75.47) v1(86.87,73.58) v1(87.74,96.77) v1(87.76,95.17) v1(87.76,93.29) v1(88.65,84.11) v1(88.7,82.22) v1(88.77,75.47) v1(88.83,73.58) v1(89.66,96.77) v1(89.66,95.17) v1(89.72,93.29)
111SERVO_PWM1: length 72.4
  Bottom Layer w0.254: CN5.3 96.39,81.92 96.39,90.09 92.71,93.78 92.71,97.33 91.44,98.6 47.12,98.6 46.61,98.09 46.61,94.16 45.97,93.52 H15.1
111SERVO_PWM2: length 16.2
  Bottom Layer w0.254: CN2.3 93.09,91.36 81.91,91.36 81.28,92 H13.1
AIN1: length 48.2
  Top Layer w0.254: 48.41,17.84 48.41,19.42 48.29,19.54 48.29,19.58 48.13,19.74 48.13,25.45 48.77,26.09 61.09,26.09 61.34,26.34 v1(61.34,49.2)
  Bottom Layer w0.254: U37.61 65.36,49.2 v1(61.34,49.2)
AIN2: length 65.5
  Top Layer w0.254: v1(60.58,63.17) 60.58,27.23 60.32,26.97 48.51,26.97 47.76,26.22 47.76,17.84
  Bottom Layer w0.254: v1(60.58,63.17) 66.63,63.17 67.94,64.48
BIN1: length 57
  Top Layer w0.254: 51.01,17.84 51.01,18.55 52.58,20.12 61.02,20.12 61.98,21.07 v1(61.98,61.9)
  Bottom Layer w0.254: U37.71 62.02,61.94 v1(61.98,61.9)
BIN2: length 46.1
  Top Layer w0.254: v1(62.63,51.74) 62.63,21.22 61.02,19.61 52.71,19.61 51.66,18.57 51.66,17.84
  Bottom Layer w0.254: U37.63 65.36,51.74 v1(62.63,51.74)
BUJIN_MOTOR1: length 33.9
  Top Layer w0.254: U37.7 31.02,65.58 33.4,65.58 33.85,66.03 CN10.3
BUJIN_MOTOR2: length 75.3
  Top Layer w0.254: U37.9 29.84,61.52 30.86,60.5 39.24,60.5 39.5,60.76 39.5,89.84 40.08,90.42 69.42,90.42 71.31,92.32 CN8.3
BUZZER: length 4.1
  Top Layer w0.254: 32.38,54.24 34.64,54.24 R40.1 R41.1
CE: length 83
  Top Layer w0.254: U2.3 4.13,15.35 5.65,15.35 6.86,14.15 6.86,10.08 7.62,9.32 12.74,9.32 13.67,8.39 25.61,8.39 26.67,9.45 26.67,53.77 v1(27.18,54.28) ; v1(27.18,59.23) 29.76,59.23 U37.11
  Bottom Layer w0.254: v1(27.18,54.28) v1(27.18,59.23)
CSN: length 42.7
  Bottom Layer w0.254: U37.29 28.23,34.85 13.46,34.85 12.83,34.21 12.83,17.34 12.3,16.81 U2.4
DC: length 6.8
  Top Layer w0.254: 52.96,17.84 52.96,16.05 ; 53.61,17.84 53.61,16.05 ; 46.46,17.84 46.46,16.05
  Top Layer w0.508: R53.2 76.96,39.04
  vias: v1(73.03,41.83) v1(72.99,40.94) v1(74.17,41.83) v1(74.15,40.94) v1(74.42,46.41) v1(74.44,45.4) v1(74.44,44.39) v1(74.42,43.34) v1(75.3,41.83) v1(75.31,40.94) v1(75.66,46.41) v1(75.66,45.4) v1(75.66,44.39) v1(75.66,43.34) v1(76.3,41.83) v1(76.3,40.98)
ICM42688_SCL: length 55.3
  Top Layer w0.254: H1.3 72.45,78.09 v1(69.2,78.09)
  Bottom Layer w0.254: v1(69.2,78.09) 68.26,78.09 68.2,78.16 35.94,78.16 35.43,77.65 35.43,68.63 34.93,68.12 31.03,68.12 U37.5
ICM42688_SDA: length 52.6
  Top Layer w0.254: H1.4 74.23,78.85 v1(69.22,78.85)
  Bottom Layer w0.254: U37.3 31.16,70.79 34.16,70.79 34.54,71.17 34.54,78.16 35.18,78.79 68.2,78.79 68.26,78.85 v1(69.22,78.85)
IRQ: length 42.4
  Bottom Layer w0.254: 5.21,11.74 6.86,13.39 16.76,13.39 17.91,14.53 17.91,31.04 18.25,31.38 U37.33
JY62_RX: length 34.8
  Top Layer w0.254: P1.4 75.95,77.9 75.95,58.09 75.44,57.58 73.09,57.58 73.08,57.59 70.65,57.59 68.74,55.68 66.77,55.68 U37.65
JY62_TX: length 78.4
  Top Layer w0.254: P1.3 79.38,78.79 79.38,81.2 79.2,81.38 76.33,81.38 75.1,82.61 73.95,82.61 73.33,83.24 68.33,83.24 67.82,82.73 v1(67.82,77.39)
  Bottom Layer w0.254: v1(67.82,77.39) 36.7,77.39 36.07,76.76 36.07,60.5 33.53,57.96 31.03,57.96 U37.13
K230_RX: length 118.4
  Top Layer w0.254: U48.2 13.09,71.16 13.97,70.28 13.97,47.27 13.6,46.9 13.6,42.84 U35.3 ; v1(40.77,63.04) 40.77,67.94 41.33,68.5 64.79,68.5 64.92,68.38 66.77,68.38 67.94,69.56
  Bottom Layer w0.254: v1(40.77,63.04) 40.77,53.26 40.39,52.88 21.46,52.88 20.95,52.38 20.95,47.3 20.26,46.6 14.29,46.6 13.59,45.9 13.59,42.85 U35.3
K230_TX: length 57.3
  Top Layer w0.254: U35.2 12.95,40.94 12.95,46.91 13.21,47.17 13.21,68.76 12.06,69.91 U48.3
  Bottom Layer w0.254: U35.2 16.26,37.64 31.2,37.64 32.38,36.46
KEY1: length 95.7
  Top Layer w0.254: R59.2 10.41,83.53 C125.2 ; KEY1.3 10.39,85.56 ; 10.39,85.56 10.42,85.52 C125.2 ; 10.39,85.56 KEY1.4 ; v1(26.03,80.31) 26.03,81.71 25.53,82.22 10.67,82.22 10.42,82.46 C125.2
  Bottom Layer w0.254: 67.94,59.4 69.26,59.4 70.61,60.76 70.61,79.68 69.98,80.31 v1(26.03,80.31)
KEY2: length 100.7
  Top Layer w0.254: KEY2.3 20.88,76.29 ; 20.88,76.29 20.95,76.21 C103.2 ; 20.88,76.29 KEY2.4 ; C103.2 20.92,74.16 R44.2 ; C103.2 20.95,74.19 v1(20.95,72.57)
  Bottom Layer w0.254: v1(20.95,72.57) 24.26,72.57 24.64,72.95 24.64,80.57 25.24,81.17 70.07,81.17 71.12,80.13 71.12,56.69 70.1,55.68 66.59,55.68 U37.67
KEY3: length 75.8
  Top Layer w0.254: C126.2 21.02,85.39 20.98,85.43 ; C126.2 21.78,82.6 26.42,82.6 27.05,81.97 v1(27.05,79.55) ; C126.2 R60.2 ; KEY3.3 20.98,85.43 ; 20.98,85.43 KEY3.4
  Bottom Layer w0.254: U37.77 66.63,70.79 69.47,70.79 70.1,71.42 70.1,79.05 69.6,79.55 v1(27.05,79.55)
KEY4: length 112.9
  Top Layer w0.254: 10.41,74.18 10.4,74.16 R46.2 ; 10.41,74.18 C102.2 10.42,76.52 10.45,76.54 ; 10.41,74.18 v1(10.41,72.95) ; 10.45,76.54 KEY4.4 ; 10.45,76.54 KEY4.3
  Bottom Layer w0.254: v1(10.41,72.95) 14.99,72.95 15.37,73.33 15.37,81.68 15.62,81.94 16.17,81.94 16.2,81.97 23.68,81.97 23.71,81.94 70.39,81.94 71.75,80.57 71.75,55.59 67.94,51.78
LED: length 13.2
  Top Layer w0.254: v1(70.36,58.22) 73.98,58.22 v1(74.11,58.35)
  Bottom Layer w0.254: LED11.1 76.68,58.35 v1(74.11,58.35) ; v1(70.36,58.22) 66.59,58.22 U37.69
MISO: length 75.9
  Top Layer w0.254: 2.67,11.74 2.67,8.94 3.3,8.31 12.32,8.31 13.25,7.37 13.66,7.37 13.83,7.19 13.83,6.83 14.01,6.66 14.16,6.66 14.34,6.83 14.34,7.19 14.52,7.37 14.67,7.37 14.85,7.19 14.85,6.83 15.03,6.66 15.18,6.66 15.36,6.83 15.36,7.19 15.54,7.37 15.69,7.37 15.87,7.19 15.87,6.83 16.05,6.66 16.2,6.66 16.38,6.83 16.38,7.19 16.55,7.37 26.25,7.37 27.69,8.81 27.69,49.54 U37.17
MOSI: length 75.9
  Bottom Layer w0.254: 5.21,14.28 16.51,14.28 16.76,14.53 16.76,22.47 16.58,22.65 15.55,22.65 15.37,22.83 15.37,22.98 15.55,23.16 16.58,23.16 16.76,23.34 16.76,23.49 16.58,23.67 15.55,23.67 15.37,23.85 15.37,24 15.55,24.18 16.58,24.18 16.76,24.36 16.76,24.51 16.58,24.69 15.55,24.69 15.37,24.87 15.37,25.01 15.55,25.19 16.58,25.19 16.76,25.37 16.76,25.52 16.58,25.7 15.55,25.7 15.37,25.88 15.37,26.03 15.55,26.21 16.58,26.21 16.76,26.39 16.76,26.54 16.58,26.72 15.55,26.72 15.37,26.9 15.37,27.05 15.55,27.23 16.58,27.23 16.76,27.41 16.76,27.56 16.58,27.73 15.55,27.73 15.37,27.91 15.37,28.06 15.55,28.24 16.58,28.24 16.76,28.42 16.76,28.57 16.58,28.75 15.55,28.75 15.37,28.93 15.37,29.08 15.55,29.26 16.58,29.26 16.76,29.44 16.76,29.59 16.58,29.77 15.55,29.77 15.37,29.95 15.37,30.09 15.55,30.27 16.58,30.27 16.76,30.45 16.76,30.6 16.58,30.78 15.55,30.78 15.37,30.96 15.37,31.11 15.55,31.29 16.58,31.29 16.76,31.47 16.76,32.44 16.89,32.56 18.09,32.56 18.27,32.38 18.27,31.99 18.44,31.81 18.59,31.81 18.77,31.99 18.77,32.38 18.95,32.56 19.1,32.56 19.28,32.38 19.28,31.99 19.46,31.81 19.61,31.81 19.79,31.99 19.79,32.38 19.97,32.56 20.12,32.56 20.3,32.38 20.3,31.99 20.48,31.81 20.63,31.81 20.81,31.99 20.81,32.38 20.98,32.56 21.13,32.56 21.31,32.38 21.31,31.99 21.49,31.81 21.64,31.81 21.82,31.99 21.82,32.38 22,32.56 22.15,32.56 22.33,32.38 22.33,31.99 22.51,31.81 22.66,31.81 22.84,31.99 22.84,32.38 23.02,32.56 23.17,32.56 23.35,32.38 23.35,31.99 23.53,31.81 23.67,31.81 23.85,31.99 23.85,32.38 24.03,32.56 24.18,32.56 24.36,32.38 24.36,31.99 24.54,31.81 24.69,31.81 24.87,31.99 24.87,32.38 25.05,32.56 25.2,32.56 25.38,32.38 25.38,31.99 25.56,31.81 25.71,31.81 25.89,31.99 25.89,32.38 26.06,32.56 26.21,32.56 26.39,32.38 26.39,31.99 26.57,31.81 26.72,31.81 26.9,31.99 26.9,32.38 27.08,32.56 27.23,32.56 27.41,32.38 27.41,31.99 27.59,31.81 27.74,31.81 27.92,31.99 27.92,32.38 28.1,32.56 29.21,32.56 29.84,33.2 U37.31
MOTOR_ENCODE1A: length 76.1
  Top Layer w0.254: U44.3 36.47,16.33 39.62,19.48 45.59,19.48 46.35,20.24 v1(46.35,38.91) ; v1(55.88,54.28) v1(59.94,54.28)
  Bottom Layer w0.254: v1(46.35,38.91) 55.37,38.91 55.88,39.42 v1(55.88,54.28) ; v1(59.94,54.28) 61.21,53.01 66.63,53.01 67.94,54.32
MOTOR_ENCODE1B: length 50.9
  Top Layer w0.254: U44.4 37.44,6.66 35.81,6.66 35.31,7.16 35.31,16.56 39.24,20.5 39.24,41.45 37.85,42.85 31.16,42.85 U37.25
MOTOR_ENCODE2A: length 80.7
  Top Layer w0.254: 32.38,41.54 37,41.54 38.48,40.06 38.48,20.88 34.54,16.94 34.54,10.97 33.78,10.21 30.99,10.21 30.23,9.45 30.23,6.02 30.61,5.64 39.43,5.64 40.2,6.4 56.54,6.4 57.31,5.64 v1(61.47,5.64)
  Bottom Layer w0.254: v1(61.47,5.64) 60.47,6.63 U45.3
MOTOR_ENCODE2B: length 73.3
  Top Layer w0.254: U37.27 28.19,37.35 28.19,8.69 29.46,7.42 29.46,5.77 30.18,5.06 39.77,5.06 40.61,5.89 56.26,5.89 57.1,5.06 63.75,5.06 64.01,5.31 v1(64.01,5.38)
  Bottom Layer w0.254: U45.4 62.97,6.42 v1(64.01,5.38)
MOTORA1: length 22.1
  Top Layer w0.254: 46.42,9.32 46.46,9.36 U40.1 ; 46.42,9.32 43.05,9.32 42.67,8.94 42.67,7.77 41.81,6.91 40.01,6.91 39.24,6.15 31.75,6.15 31.47,6.43 U44.1 ; 46.42,9.32 46.74,9.32 47.11,9.7 U40.2
MOTORA2: length 10.7
  Top Layer w0.254: 49.07,8.18 49.06,8.18 U40.5 ; 49.07,8.18 U44.6 ; 49.07,8.18 49.53,8.18 49.71,8.36 49.71,10.71
MOTORB1: length 21.6
  Top Layer w0.254: 53.58,9.32 56.11,9.32 56.9,8.53 56.9,6.78 57.4,6.27 67.69,6.27 67.97,6.56 U45.6 ; 53.58,9.32 53.61,9.35 U40.12 ; 53.58,9.32 53.21,9.32 52.96,9.58 52.96,10.71 U40.11
MOTORB2: length 10.3
  Top Layer w0.254: U40.8 51.01,8.08 50.98,8.05 ; 50.98,8.05 50.55,8.05 50.36,8.24 U40.7 ; 50.98,8.05 U45.1
OLED_SCL: length 18.4
  Top Layer w0.254: H12.3 21.34,59.61 22.99,61.27 22.99,66.73 24.38,68.12 31.2,68.12 32.38,66.94
OLED_SDA: length 26.7
  Top Layer w0.254: H12.4 20.07,58.22 20.07,70.41 20.32,70.66 31.2,70.66 32.38,69.48
PA07: length 5.4
  Top Layer w0.254: 67.94,34 67.99,33.96 H16.2
PA22: length 75
  Bottom Layer w0.254: U46.8 48.26,10.5 51.27,13.51 57.02,13.51 57.53,14.02 57.53,59.23 59.06,60.76 66.76,60.76 67.94,61.94
PA25: length 80.6
  Bottom Layer w0.254: U37.75 57.95,67.02 56.49,65.56 56.49,15.33 55.81,14.66 50.8,14.66 47.12,10.97 47.12,7.67 43.18,3.73 U46.10
PA29: length 39.9
  Bottom Layer w0.254: U46.14 28.07,2.97 27.81,3.23 27.81,9.66 30.48,12.33 30.48,19.96 31.27,20.75 34.29,20.75 34.67,21.13 34.67,30.66 33.95,31.38 32.38,31.38
PA30: length 53.3
  Bottom Layer w0.254: U46.5 55.88,3.99 54.86,5 52.58,5 49.78,7.8 49.78,9.87 51.9,11.99 58.67,11.99 58.93,12.24 58.93,37.52 60.49,39.08 U37.53
PB0: length 52.1
  Bottom Layer w0.254: U46.4 58.42,4.12 57.02,5.51 52.95,5.51 50.29,8.17 50.29,9.66 52.11,11.48 59.06,11.48 59.31,11.74 59.31,34.59 61.25,36.54 U37.51
PB01: length 55.6
  Bottom Layer w0.254: 67.94,36.54 66.76,35.36 61.59,35.36 59.69,33.45 59.69,11.23 59.44,10.97 52.32,10.97 50.8,9.45 50.8,8.43 53.21,6.02 59.18,6.02 60.96,4.24 U46.3
PB2: length 75.9
  Top Layer w0.254: 2.67,14.28 4.06,12.88 4.06,9.45 4.7,8.81 12.53,8.81 13.46,7.88 25.99,7.88 27.19,9.08 27.19,51.37 29.84,54.03 U37.15
PB9: length 50.9
  Bottom Layer w0.254: 32.38,39 34.84,39 35.81,38.02 35.81,20.75 34.67,19.61 32.64,19.61 31.75,18.72 31.75,11.51 28.96,8.72 28.96,6.15 29.21,5.89 36.32,5.89 38.1,4.12 U46.12
PB13: length 65.6
  Bottom Layer w0.254: 32.38,51.7 35.47,51.7 36.17,51 36.17,20.09 34.93,18.85 33.15,18.85 32.38,18.08 32.38,11.23 29.46,8.31 29.46,6.66 29.72,6.4 38.35,6.4 40.64,4.12 U46.11
PB14: length 5.4
  Top Layer w0.254: H16.1 73.24,31.46 67.94,31.46
PB21: length 53.5
  Bottom Layer w0.254: U46.7 50.8,5.26 48.77,7.29 48.77,10.29 51.48,13 57.78,13 58.04,13.26 58.04,40.06 59.6,41.62 U37.55
PB22: length 55.7
  Bottom Layer w0.254: 67.94,41.62 66.76,40.44 60.32,40.44 58.55,38.66 58.55,12.75 58.29,12.5 51.69,12.5 49.28,10.08 49.28,7.54 53.34,3.48 U46.6
PB25: length 76.9
  Bottom Layer w0.254: U46.9 45.72,5.26 47.75,7.29 47.75,10.71 51.06,14.02 56.59,14.02 57.02,14.45 57.02,62.92 58.59,64.48 U37.73
PB26: length 43.4
  Bottom Layer w0.254: U46.13 35.56,3.48 33.66,5.38 28.7,5.38 28.45,5.64 28.45,9.2 31.12,11.87 31.12,19.21 32.02,20.12 34.42,20.12 35.31,21.01 35.31,32.94 34.33,33.92 32.38,33.92
PWMA: length 61.2
  Top Layer w0.254: 32.38,64.4 38.19,64.4 v1(38.23,64.44) ; 47.11,17.84 47.11,45.25 47.14,45.28 47.14,46.26 47.11,46.29 47.11,64.06 46.74,64.44 v1(41.78,64.44)
  Bottom Layer w0.254: v1(38.23,64.44) v1(41.78,64.44)
PWMB: length 62.2
  Top Layer w0.254: 67.94,67.02 66.63,65.71 63.91,65.71 63.28,65.08 63.28,21.16 61.21,19.1 52.83,19.1 52.31,18.58 52.31,17.84
SCREEN_RX: length 29.6
  Top Layer w0.254: CN7.3 24.36,41.31 U54.1 24.38,57.58 24.89,58.09 31.62,58.09 32.38,58.85 32.38,59.32
SCREEN_TX: length 28.3
  Top Layer w0.254: 32.38,56.78 31.03,55.42 26.42,55.42 25.78,54.79 25.78,40.18 U54.2 24.36,38.81 CN7.2
SERVO_PWM1: length 129.7
  Top Layer w0.254: CN10.4 31.35,98.84 31.88,99.37 44.07,99.37 44.32,99.11 H15.2 ; v1(80.01,69.14) 80.01,57.84 76.45,54.28 72.39,54.28 71.37,53.26 71.37,43.8 69.62,42.05 69.62,36.02 68.83,35.23 66.63,35.23 U37.49
  Bottom Layer w0.254: H15.2 42.8,94.54 42.8,91.77 43.05,91.52 45.65,91.52 47.02,92.89 51.56,92.89 52.93,91.52 78.71,91.52 80.01,90.22 v1(80.01,69.14)
SERVO_PWM2: length 99.5
  Top Layer w0.254: H13.2 81.28,98.98 80.9,99.37 69.85,99.37 68.81,98.33 CN8.4 ; v1(80.9,61.39) v1(80.9,69.14)
  Bottom Layer w0.254: v1(80.9,69.14) 80.9,91.11 79.76,92.25 79.76,94.67 H13.2 ; v1(80.9,61.39) 80.9,59.74 78.23,57.07 75.18,57.07 71.37,53.26 71.37,29.77 70.74,29.13 69.77,29.13 68.79,30.11 67.62,30.11 66.28,31.46 U37.47
SERVO_PWM3: length 55.4
  Top Layer w0.254: 67.94,28.92 69.72,30.7 v1(70.49,30.7)
  Bottom Layer w0.254: CN6.3 80.01,62.03 79.38,61.39 79.38,59.11 77.98,57.71 74.55,57.71 70.49,53.64 v1(70.49,30.7)
SERVO_PWM4: length 45.2
  Top Layer w0.254: 67.94,49.24 70.02,49.24 70.61,49.83 70.61,53.52 72.01,54.92 76.2,54.92 79.25,57.96 79.25,69.9 80.52,71.17 v1(89.53,71.17)
  Bottom Layer w0.254: v1(89.53,71.17) 94.83,71.17 CN4.3
UART1_RX: length 83
  Top Layer w0.254: CN10.1 38.85,62.39 38.31,61.86 32.38,61.86 ; CN8.1 76.31,89.45 75.69,88.82 v1(41.15,88.82)
  Bottom Layer w0.254: v1(41.15,88.82) v1(38.86,88.82)
UART1_TX: length 83.1
  Top Layer w0.254: v1(41.15,89.8) 73.1,89.8 73.81,90.51 CN8.2 ; CN10.2 v1(36.35,89.8) ; 67.94,56.86 68.62,56.86 69.72,57.96 69.72,73.08 67.06,75.74 v1(67.06,86.16)
  Bottom Layer w0.254: v1(36.35,89.8) v1(41.15,89.8) ; v1(67.06,86.16) v1(67.06,89.84)
$1N2290: length 4.8
  Top Layer w0.254: SW3.2 83.69,46.66 Q1.4
$1N5297: length 1.8
  Top Layer w0.508: LED4.2 9.77,52.55 R55.1
$1N5300: length 1.7
  Top Layer w0.254: R54.1 16,9.58 LED5.2
$1N5302: length 1.7
  Top Layer w0.254: LED7.2 79.97,38.94 R53.1
$1N5303: length 1.7
  Top Layer w0.254: R11.2 90.17,9.95 LED8.2
$1N7215: length 1.8
  Top Layer w0.508: R42.2 81.54,37.33 81.48,37.27
$2N1558: length 1.8
  Top Layer w0.254: LED11.2 77.61,61.89 R58.1
$2N4473: length 14.9
  Top Layer w0.508: R39.2 37.59,50.6 38.36,49.83 BUZZER2.1 41.13,43 D1.1
$2N4474: length 20.6
  Top Layer w0.508: 42.43,45.73 42.48,45.77 BUZZER2.2 ; 42.43,45.73 42.43,53.12 42.16,53.39 Q2.3 ; 42.43,45.73 D1.2
$2N4475: length 1.7
  Top Layer w0.254: 37.89,54.34 37.83,54.28 R40.2

## Copper pours and planes (outline as drawn; the poured copper is in the pictures)
3.3V on Top Layer: 3.56,44.12 4.57,43.1 6.6,43.1 7.62,42.09 11.98,42.09 12.54,42.64 12.54,51.14 11.98,51.7 10.78,51.7 10.53,51.44 10.53,49.69 10.29,49.45 8.23,49.45 7.46,48.69 4.57,48.69 3.56,47.68
5V on Top Layer: 7.08,23.11 8.08,24.11 15.56,24.11 16.38,23.29 16.38,14.66 15.62,13.89 8,13.89 7.08,14.82
24V_1 on Top Layer: 12.06,41.83 12.06,32.01 12.03,31.98 4.01,31.98 3.68,32.31 3.68,37.1 3.92,37.34 6.81,37.34 7.28,37.81 7.28,41.37 7.75,41.83
24V_2 on Top Layer: 91.69,31.98 92.54,32.83 92.54,41.24 91.95,41.83 87.88,41.83 86.1,40.05 82.56,40.05 82.3,39.79 82.3,38.53 82.55,38.28 83.9,38.28 84.33,37.85 84.33,32.91 84.67,32.56 86.9,32.56 87.46,32 91.67,32
+5V on Top Layer: 18.94,25.45 18.8,25.2 18.67,24.89 18.67,21.26 17.91,20.5 17.91,17.07 18.54,16.43 18.54,13.51 17.91,12.88 17.91,11 18.42,10.49 18.42,8.94 18.67,8.69 20.32,8.69 21.59,9.96 21.59,25.2 21.34,25.45
+5V on Top Layer: 18.8,13.89 15.93,13.89 15.42,13.39 15.42,10.92 15.62,10.72 18.16,10.72 18.42,10.47 18.8,10.85
+6V on Top Layer: 88.14,24.31 87.63,23.8 87.63,9.16 88,8.79 89.13,8.79 89.41,9.07 89.41,10.97 89.79,11.35 97.92,11.35 98.3,11.74 98.3,54.53 97.79,55.04 93.09,55.04 92.84,55.3 92.84,57.96 93.09,58.22 96.9,58.22 97.16,58.47 97.16,60.26 96.65,60.77 93.84,60.77 93.34,61.27 93.34,66.98 93.73,67.36 96.65,67.36 97.03,67.74 97.03,69.55 96.65,69.93 93.32,69.93 93.32,76.22 93.73,76.63 96.52,76.63 97.03,77.14 97.03,78.66 96.65,79.04 93.72,79.04 93.47,79.13 93.47,85.65 93.6,85.78 96.13,85.78 96.65,86.3 96.65,87.81 96.01,88.44 90.68,88.44 90.42,88.19 90.42,54.03 93.73,50.72 93.73,25.07 92.96,24.31
GND on Top Layer: -33.66,125.4 126.11,125.4 126.11,-19.63 -33.66,-19.63
GND on Bottom Layer: -30.73,116 136.4,116 136.4,-21.03 -30.73,-21.03
+POW on Top Layer: 81.03,41.07 81.03,41.83 78.49,41.83 77.72,42.6 77.72,45.38 78.24,45.9 81.91,45.9 82.17,45.64 82.17,44.5 86.61,44.5 87.46,45.35 87.46,49.28 87.96,49.78 89.24,49.78 89.81,50.35 89.81,51.77 90.42,52.38 91.44,52.38 92.84,50.98 92.84,42.85 92.07,42.09 87.5,42.09 86.11,40.69 81.41,40.69
DC on Top Layer: 78.1,15.16 54.48,15.16 53.72,14.4 46.23,14.4 46.1,14.53 46.1,15.42 45.97,15.54 45.97,16.43 46.1,16.56 53.97,16.56 55.12,17.7 60.51,17.7 62.16,19.35 72.9,19.35 75.06,21.51 75.06,34.85 74.65,35.48 72.14,35.48 72.14,47.55 77.47,47.55 77.47,36.88 78.99,35.36 78.99,16.05
DC on Bottom Layer: 83.82,56.69 83.82,54.03 82.93,53.14 78.87,53.14 77.72,51.99 77.72,41.2 77.22,40.69 72.64,40.69 72.14,41.2 72.14,53.52 72.64,54.03 75.05,54.03 77.84,56.82 78.99,56.82 80.01,57.84 82.68,57.84
$1N2192 on Top Layer: 87.88,50.22 88.52,50.85 88.52,54.15 88.14,54.53 83.32,54.53 81.8,53.01 81.8,50.59 82.17,50.22

Small or netless copper shapes (teardrops, artwork), in the pictures only: 197 on Top Layer, 96 on Bottom Layer

## Text on the board
Top Silkscreen Layer: MISO | 3.3V | GND | 24V | IRQ | OLED_SDA | OLED_SCL | 5V | PA07 | PB14 | RX | TX | SC-RX | SC-TX | SERVO | ICM-SDA | ICM-SCL | J-RX | J-TX | 24v | 12V | DC | 6v | 串口屏 | 烧录接口 | 5V按键 | 12V按键
